# Altium schematic sheet 数控频率计.SCHDOC
size A4
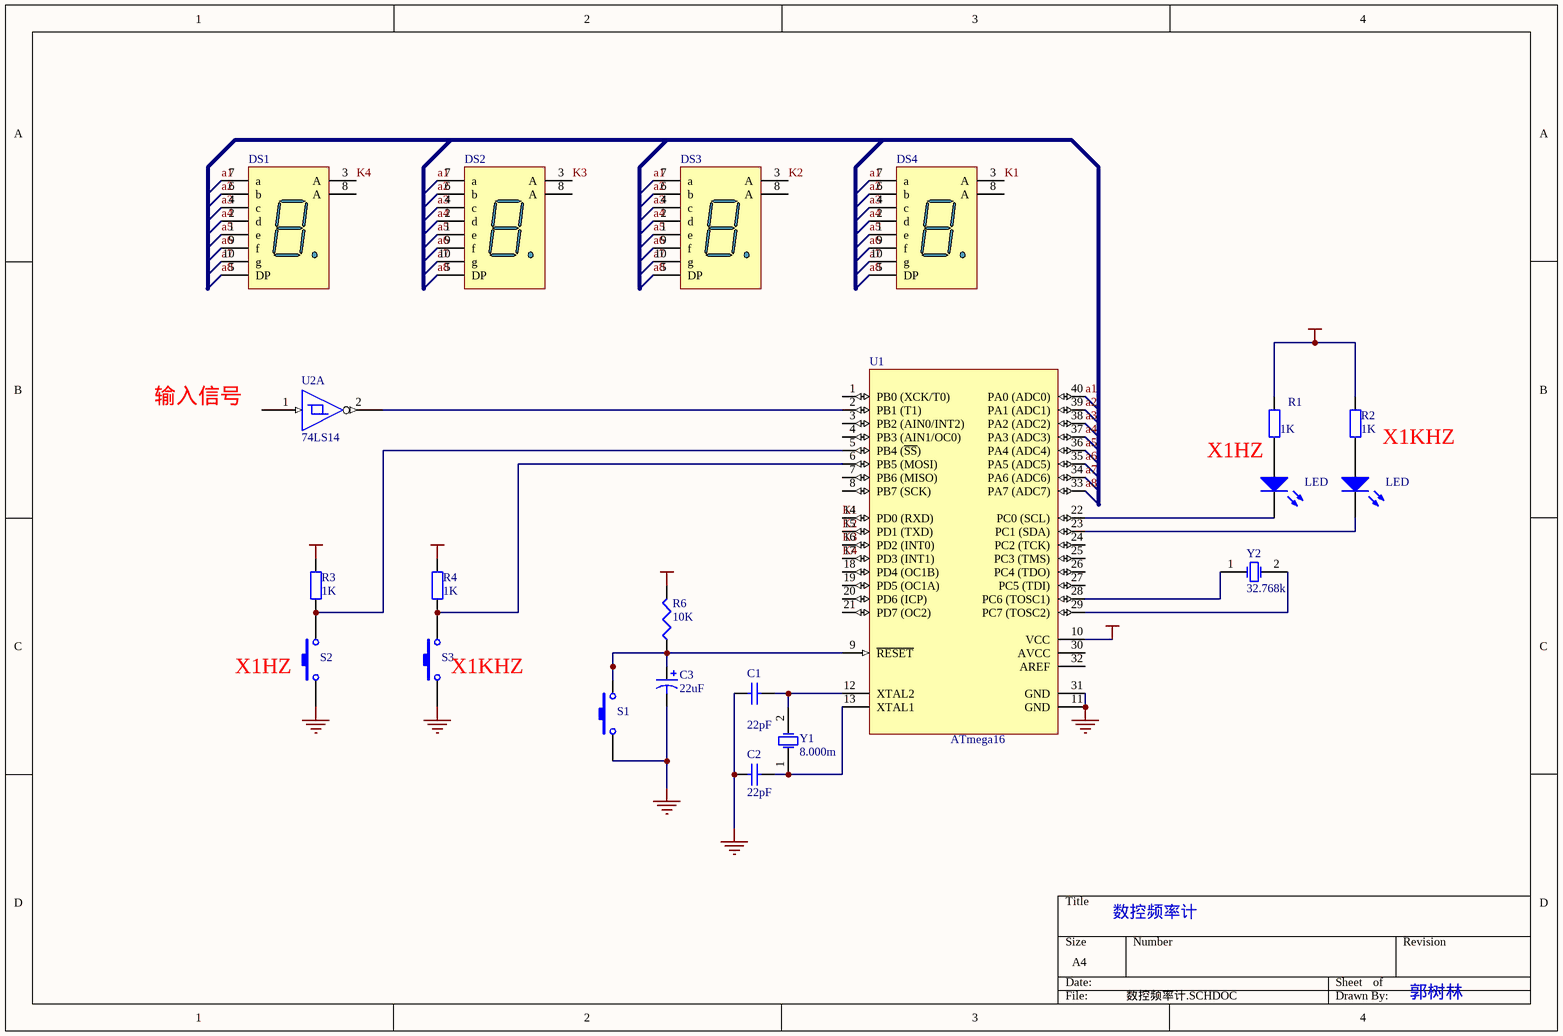
[diagram p0: 数控频率计.SCHDOC]

## Parts
(Parts that share a designator on the sheet are numbered #1, #2 ... from top to bottom, then left to right.)
C1  value 22pF  [RAD-0.3]  (hidden comment: Cap)
C2  value 22pF  [RAD-0.3]  (hidden comment: Cap)
C3  value 22uF  [CC2012-0805]  (hidden comment: Cap Pol3)
DS1  Dpy Blue-CA  [LEDDIP-10/C15.24RHD]  (value not drawn)
DS2  Dpy Blue-CA  [LEDDIP-10/C15.24RHD]  (value not drawn)
DS3  Dpy Blue-CA  [LEDDIP-10/C15.24RHD]  (value not drawn)
DS4  Dpy Blue-CA  [LEDDIP-10/C15.24RHD]  (value not drawn)
LED#1  LED0  [LED-0]  (value not drawn)
LED#2  LED0  [LED-0]  (value not drawn)
R1  value 1K  [AXIAL-0.4]  (hidden comment: Res2)
R2  value 1K  [AXIAL-0.4]  (hidden comment: Res2)
R3  value 1K  [AXIAL-0.4]  (hidden comment: Res2)
R4  value 1K  [AXIAL-0.4]  (hidden comment: Res2)
R6  value 10K  [C1608-0603]  (hidden comment: Res3)
S1  SW-PB  [SPST-2]  (value not drawn)
S2  SW-PB  [SPST-2]  (value not drawn)
S3  SW-PB  [SPST-2]  (value not drawn)
U1  ATmega16  [40P6]
U2  74LS14  [DIP-14]  (part A of 6)
Y1  8.000m  [BCY-W2/D3.1]
Y2  32.768k  [BCY-W2/D3.1]

## Nets
GND: C1.1 C2.2 C3.2 S1.1 S2.1 S3.1 U1.11(GND) U1.31(GND) U2.7(GND)
VCC: R1.2 R2.2 R3.2 R4.2 R6.2 U1.10(VCC) U2.14(VCC)
a1: DS1.7(a) DS2.7(a) DS3.7(a) DS4.7(a) U1.40(PA0_(ADC0))
a2: DS1.6(b) DS2.6(b) DS3.6(b) DS4.6(b) U1.39(PA1_(ADC1))
a3: DS1.4(c) DS2.4(c) DS3.4(c) DS4.4(c) U1.38(PA2_(ADC2))
a4: DS1.2(d) DS2.2(d) DS3.2(d) DS4.2(d) U1.37(PA3_(ADC3))
a5: DS1.1(e) DS2.1(e) DS3.1(e) DS4.1(e) U1.36(PA4_(ADC4))
a6: DS1.9(f) DS2.9(f) DS3.9(f) DS4.9(f) U1.35(PA5_(ADC5))
a7: DS1.10(g) DS2.10(g) DS3.10(g) DS4.10(g) U1.34(PA6_(ADC6))
a8: DS1.5(DP) DS2.5(DP) DS3.5(DP) DS4.5(DP) U1.33(PA7_(ADC7))
K1: DS4.3(A) U1.14(PD0_(RXD))
K2: DS3.3(A) U1.15(PD1_(TXD))
K3: DS2.3(A) U1.16(PD2_(INT0))
K4: DS1.3(A) U1.17(PD3_(INT1))
NetC1_2: C1.2 U1.12(XTAL2) Y1.2(OSC2)
NetC2_1: C2.1 U1.13(XTAL1) Y1.1(OSC1)
NetC3_1: C3.1 R6.1 S1.2 U1.9(~{RESET})
NetLED#1_1: LED#1.1(A) R1.1
NetLED#1_2: LED#1.2(K) U1.22(PC0_(SCL))
NetLED#2_1: LED#2.1(A) R2.1
NetLED#2_2: LED#2.2(K) U1.23(PC1_(SDA))
NetR3_1: R3.1 S2.2 U1.5(PB4_(~{SS}))
NetR4_1: R4.1 S3.2 U1.6(PB5_(MOSI))
NetU1_2: U1.2(PB1_(T1)) U2.2
NetU1_28: U1.28(PC6_(TOSC1)) Y2.1(OSC1)
NetU1_29: U1.29(PC7_(TOSC2)) Y2.2(OSC2)

Not connected (* = marked no-connect by the designer): DS1 8(A); DS2 8(A); DS3 8(A); DS4 8(A); U1 1(PB0_(XCK/T0)) 3(PB2_(AIN0/INT2)) 4(PB3_(AIN1/OC0)) 7(PB6_(MISO)) 8(PB7_(SCK)) 18(PD4_(OC1B)) 19(PD5_(OC1A)) 20(PD6_(ICP)) 21(PD7_(OC2)) 24(PC2_(TCK)) 25(PC3_(TMS)) 26(PC4_(TDO)) 27(PC5_(TDI)) 30(AVCC) 32(AREF); U2 1

## Notes on the sheet
- 输入信号
- X1KHZ
- X1HZ
- (near S2) X1HZ
- (near S3) X1KHZ
- 数控频率计
- 郭树林

## Library data of the parts
C1 C2 = Cap: Capacitor; Published: 8-Jun-2000; LatestRevisionDate: 17-Jul-2002; LatestRevisionNote: Re-released for DXP Platform.; Publisher: Altium Limited
C3 = Cap Pol3: Polarized Capacitor (Surface Mount); Published: 8-Jun-2000; LatestRevisionDate: 17-Jul-2002; LatestRevisionNote: Re-released for DXP Platform.; PackageReference: C0805; Publisher: Altium Limited
DS1-DS4 = Dpy Blue-CA: 14.2 mm General Purpose Blue 7-Segment Display: CA, RH DP, Gray Surface; MinimumIntensity: 2020 ucd; Note: IF = 10 mA; Published: 8-Jun-2000; LatestRevisionDate: 17-Dec-2003; LatestRevisionNote: Schematic revised, PCB Footprint replaced.; DatasheetDocument: 24-Sep-2002; PackageDocument: 24-Sep-2002; PackageReference: H; Publisher: Altium Limited; Colour: Blue
LED#1 LED#2 = LED0: Typical INFRARED GaAs LED; Published: 8-Jun-2000; LatestRevisionDate: 17-Jul-2002; LatestRevisionNote: Re-released for DXP Platform.; Publisher: Altium Limited
R1-R4 = Res2: Resistor; Published: 8-Jun-2000; LatestRevisionDate: 17-Jul-2002; LatestRevisionNote: Re-released for DXP Platform.; Publisher: Altium Limited
R6 = Res3: Resistor; Published: 8-Jun-2000; LatestRevisionDate: 17-Jul-2002; LatestRevisionNote: Re-released for DXP Platform.; Publisher: Altium Limited
S1-S3 = SW-PB: Switch; Published: 24-Mar-1999; LatestRevisionDate: 17-Jul-2002; LatestRevisionNote: Re-released for DXP Platform.; Publisher: Altium Limited
U1 = ATmega16-16PI: 8-Bit AVR Microcontroller with 16K Bytes of In-System Programmable Flash Memory; Published: 17-Sep-2003; LatestRevisionDate: 4-Mar-2005; LatestRevisionNote: Stylized 3D Model Added.; DatasheetDocument: 2466E-AVR-10/02; PackageDocument: Dec-1999; PackageReference: 40P6; Publisher: Altium Limited; ComponentLink1Description: Manufacturer Link; ComponentLink1URL: http://www.atmel.com; ComponentLink2Description: Datasheet; ComponentLink2URL: http://www.atmel.com/dyn/resources/prod_documents/doc2466.pdf
Y1 Y2 = XTAL: Crystal Oscillator; Published: 8-Jun-2000; LatestRevisionDate: 17-Jul-2002; LatestRevisionNote: Re-released for DXP Platform.; Publisher: Altium Limited